# Altium schematic sheet Actuator Controller.SchDoc
size A4; SheetNumber: 1; SheetTotal: 1
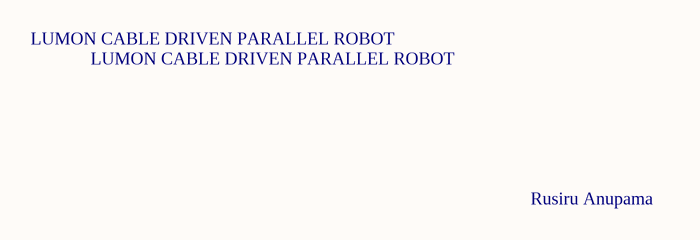
[diagram p0: Actuator Controller.SchDoc]

## Notes on the sheet
- LUMON CABLE DRIVEN PARALLEL ROBOT
- Rusiru Anupama